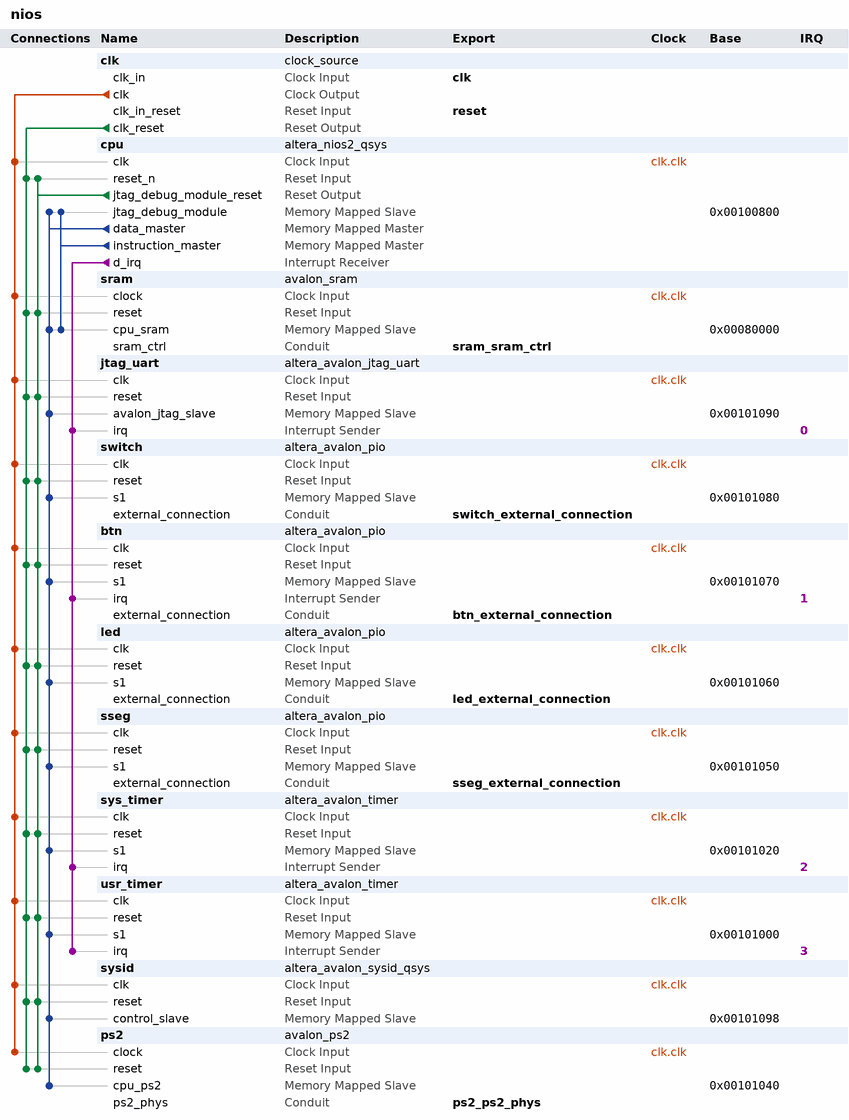
[diagram p0: system contents]
# Platform Designer (Qsys) system nios, Cyclone IV GX Unknown
# Parameters at their usual value, and those the tool derives, are not listed.
package require -exact qsys 13.0.1.99.2
create_system nios
set_project_property DEVICE_FAMILY {Cyclone IV GX}
set_project_property DEVICE Unknown

add_instance clk clock_source 13.0
set_instance_parameter_value clk clockFrequency 50000000

add_instance cpu altera_nios2_qsys 13.0
set_instance_parameter_value cpu resetSlave sram.cpu_sram
set_instance_parameter_value cpu mmu_TLBMissExcSlave None
set_instance_parameter_value cpu exceptionSlave sram.cpu_sram
set_instance_parameter_value cpu breakSlave cpu.jtag_debug_module
set_instance_parameter_value cpu impl Tiny
set_instance_parameter_value cpu icache_size 4096

add_instance sram avalon_sram 1.0

add_instance jtag_uart altera_avalon_jtag_uart 13.0.1.99.2
set_instance_parameter_value jtag_uart simInteractiveOptions NO_INTERACTIVE_WINDOWS

add_instance switch altera_avalon_pio 13.0.1.99.2
set_instance_parameter_value switch direction Input
set_instance_parameter_value switch width 10

add_instance btn altera_avalon_pio 13.0.1.99.2
set_instance_parameter_value btn captureEdge true
set_instance_parameter_value btn direction Input
set_instance_parameter_value btn generateIRQ true
set_instance_parameter_value btn irqType EDGE
set_instance_parameter_value btn width 4

add_instance led altera_avalon_pio 13.0.1.99.2
set_instance_parameter_value led direction Output
set_instance_parameter_value led width 18

add_instance sseg altera_avalon_pio 13.0.1.99.2
set_instance_parameter_value sseg direction Output
set_instance_parameter_value sseg width 32

add_instance sys_timer altera_avalon_timer 13.0.1.99.2
set_instance_parameter_value sys_timer period 1
set_instance_parameter_value sys_timer periodUnits MSEC

add_instance usr_timer altera_avalon_timer 13.0.1.99.2
set_instance_parameter_value usr_timer period 1
set_instance_parameter_value usr_timer periodUnits MSEC

add_instance sysid altera_avalon_sysid_qsys 13.0
set_instance_parameter_value sysid id 0

add_instance ps2 avalon_ps2 1.0
set_instance_parameter_value ps2 W_SIZE 2

# connections
add_connection clk.clk btn.clk clock
add_connection clk.clk cpu.clk clock
add_connection clk.clk jtag_uart.clk clock
add_connection clk.clk led.clk clock
add_connection clk.clk ps2.clock clock
add_connection clk.clk sram.clock clock
add_connection clk.clk sseg.clk clock
add_connection clk.clk switch.clk clock
add_connection clk.clk sys_timer.clk clock
add_connection clk.clk sysid.clk clock
add_connection clk.clk usr_timer.clk clock
add_connection clk.clk_reset btn.reset reset
add_connection clk.clk_reset cpu.reset_n reset
add_connection clk.clk_reset jtag_uart.reset reset
add_connection clk.clk_reset led.reset reset
add_connection clk.clk_reset ps2.reset reset
add_connection clk.clk_reset sram.reset reset
add_connection clk.clk_reset sseg.reset reset
add_connection clk.clk_reset switch.reset reset
add_connection clk.clk_reset sys_timer.reset reset
add_connection clk.clk_reset sysid.reset reset
add_connection clk.clk_reset usr_timer.reset reset
add_connection cpu.jtag_debug_module_reset btn.reset reset
add_connection cpu.jtag_debug_module_reset cpu.reset_n reset
add_connection cpu.jtag_debug_module_reset jtag_uart.reset reset
add_connection cpu.jtag_debug_module_reset led.reset reset
add_connection cpu.jtag_debug_module_reset ps2.reset reset
add_connection cpu.jtag_debug_module_reset sram.reset reset
add_connection cpu.jtag_debug_module_reset sseg.reset reset
add_connection cpu.jtag_debug_module_reset switch.reset reset
add_connection cpu.jtag_debug_module_reset sys_timer.reset reset
add_connection cpu.jtag_debug_module_reset sysid.reset reset
add_connection cpu.jtag_debug_module_reset usr_timer.reset reset
add_connection cpu.data_master btn.s1 avalon
set_connection_parameter_value cpu.data_master/btn.s1 baseAddress 0x00101070
add_connection cpu.data_master cpu.jtag_debug_module avalon
set_connection_parameter_value cpu.data_master/cpu.jtag_debug_module baseAddress 0x00100800
add_connection cpu.data_master jtag_uart.avalon_jtag_slave avalon
set_connection_parameter_value cpu.data_master/jtag_uart.avalon_jtag_slave baseAddress 0x00101090
add_connection cpu.data_master led.s1 avalon
set_connection_parameter_value cpu.data_master/led.s1 baseAddress 0x00101060
add_connection cpu.data_master ps2.cpu_ps2 avalon
set_connection_parameter_value cpu.data_master/ps2.cpu_ps2 baseAddress 0x00101040
add_connection cpu.data_master sram.cpu_sram avalon
set_connection_parameter_value cpu.data_master/sram.cpu_sram baseAddress 0x00080000
add_connection cpu.data_master sseg.s1 avalon
set_connection_parameter_value cpu.data_master/sseg.s1 baseAddress 0x00101050
add_connection cpu.data_master switch.s1 avalon
set_connection_parameter_value cpu.data_master/switch.s1 baseAddress 0x00101080
add_connection cpu.data_master sys_timer.s1 avalon
set_connection_parameter_value cpu.data_master/sys_timer.s1 baseAddress 0x00101020
add_connection cpu.data_master sysid.control_slave avalon
set_connection_parameter_value cpu.data_master/sysid.control_slave baseAddress 0x00101098
add_connection cpu.data_master usr_timer.s1 avalon
set_connection_parameter_value cpu.data_master/usr_timer.s1 baseAddress 0x00101000
add_connection cpu.instruction_master cpu.jtag_debug_module avalon
set_connection_parameter_value cpu.instruction_master/cpu.jtag_debug_module baseAddress 0x00100800
add_connection cpu.instruction_master sram.cpu_sram avalon
set_connection_parameter_value cpu.instruction_master/sram.cpu_sram baseAddress 0x00080000
add_connection cpu.d_irq btn.irq interrupt
set_connection_parameter_value cpu.d_irq/btn.irq irqNumber 1
add_connection cpu.d_irq jtag_uart.irq interrupt
set_connection_parameter_value cpu.d_irq/jtag_uart.irq irqNumber 0
add_connection cpu.d_irq sys_timer.irq interrupt
set_connection_parameter_value cpu.d_irq/sys_timer.irq irqNumber 2
add_connection cpu.d_irq usr_timer.irq interrupt
set_connection_parameter_value cpu.d_irq/usr_timer.irq irqNumber 3

# exported interfaces
add_interface clk clock sink
set_interface_property clk EXPORT_OF clk.clk_in
add_interface reset reset sink
set_interface_property reset EXPORT_OF clk.clk_in_reset
add_interface switch_external_connection conduit end
set_interface_property switch_external_connection EXPORT_OF switch.external_connection
add_interface btn_external_connection conduit end
set_interface_property btn_external_connection EXPORT_OF btn.external_connection
add_interface led_external_connection conduit end
set_interface_property led_external_connection EXPORT_OF led.external_connection
add_interface sseg_external_connection conduit end
set_interface_property sseg_external_connection EXPORT_OF sseg.external_connection
add_interface ps2_ps2_phys conduit end
set_interface_property ps2_ps2_phys EXPORT_OF ps2.ps2_phys
add_interface sram_sram_ctrl conduit end
set_interface_property sram_sram_ctrl EXPORT_OF sram.sram_ctrl

set_interconnect_requirement {$system} qsys_mm.clockCrossingAdapter HANDSHAKE
set_interconnect_requirement {$system} qsys_mm.maxAdditionalLatency 1

save_system nios.qsys
